# EAGLE design demo (EAGLE 9.6.2)
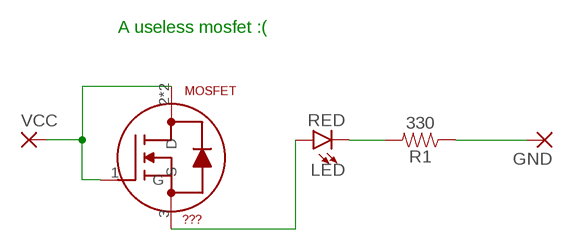
[diagram p0: schematic, sheet 1]

## Parts
GND  SMD2  [SMD1,27-2,54]
LED  RED  LED-RED1206  [LED-1206]
MOSFET  ???  CSTM_MOSFET  [CSTM_MOSFET]
R1  330  RESISTOR1206  [1206]
VCC  SMD2  [SMD1,27-2,54]

## Nets
N$1: GND.1(P) R1.1
N$2: LED.C R1.2
N$3: MOSFET.1(G) MOSFET.2(D) MOSFET.2B(D) VCC.1(P)
N$4: LED.A MOSFET.3(S)

## Notes on the sheet
- A useless mosfet :(

## Library data of the parts
GND VCC = wirepad:SMD2: SMD PAD
LED = SparkFun-LED:LED-RED: Red SMD LED Used in manufacturing of most products at SparkFun Packages: 0603 - SMD 0603 package [Product Link] <http://docs.avagotech.com/docs/AV02-0551EN> 0603 SMART - SMD 0603 SMART package ( more efficient and expensive)[Product Link] <http://www.osram-os.com/Graphics/XPic2/00077099_0.pdf> 1206 - SMD1206 package [Product Link] <https://www.sparkfun.com/datasheets/DevTools/LilyPad/Q150OVS4.pdff> SparkFun Products: Pro Mini 328 -5V <https://www.sparkfun.com/products/821> RedBoard <https://www.sparkfun.com/products/12757> IOIO-OTG <https://www.sparkfun.com/products/13613>; PROD_ID: DIO-09912
MOSFET = mylib:CSTM_MOSFET
R1 = SparkFun-Resistors:RESISTOR: Generic Resistor Package

## Board
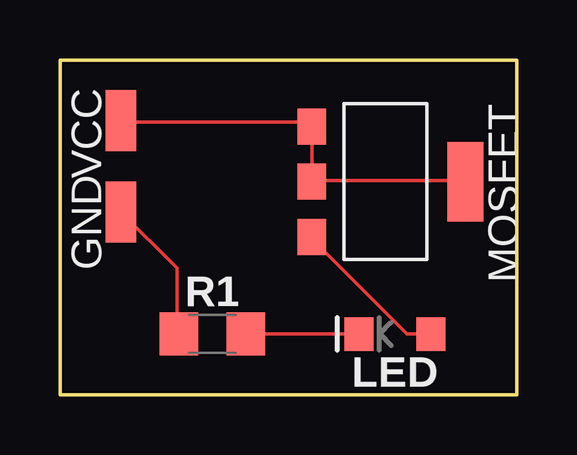
[diagram p1: board, top side]

Size 19.05 x 13.97 mm. Coordinates in mm from the lower left corner, seen from the top.
Outline: 0,0 0,13.97 19.05,13.97 19.05,0 0,0
Copper layers (1*16): Top 0.035mm / dielectric 1.5mm / Bottom 0.035mm
Design rules "default": minimum track width 6mil, minimum drill 0.35mm, track to track 6mil, track to pad 6mil, pad to pad 6mil, via to via 6mil, smd to smd 6mil, copper to edge 40mil, drill to drill 6mil, minimum pad ring 10mil, minimum via ring 8mil, stop-mask expansion 4mil, vias tented up to drill 0mil, thermal gap 10mil

### Footprints (pad centres in the part's own frame; a part is rotated, then mirrored left to right if it is on the bottom)
SMD1,27-2,54 = smd 1.27 x 2.54: 1 0,0
LED-1206 = smd 1.2 x 1.4: A -1.5,0; C 1.5,0
CSTM_MOSFET = smd 1.5 x 1.2: 1 -2.3,-2.2; 2 0,-2.2; 3 2.3,-2.2 | smd 3.3 x 1.5: 2B 0,4.2
1206 = smd 1.6 x 1.8: 1 -1.4,0; 2 1.4,0

### Placement (x,y rotation side)
GND  2.54,7.62 0 top
LED  13.97,2.54 180 top
MOSFET  12.7,8.89 270 top
R1  6.35,2.54 0 top
VCC  2.54,11.43 0 top

### Tracks (layer width: path | path; a pad name or v marks a point on that pad's centre or on a via)
N$1
  Top 0.152: 2.56,7.62 GND.1 4.88,5.28 4.88,2.54 R1.1
N$2
  Top 0.152: R1.2 LED.C
N$3
  Top 0.152: 10.52,8.94 10.52,11.07 MOSFET.1 10.36,11.23 10.21,11.38 2.59,11.38 VCC.1 | 10.52,8.94 16.76,8.94 MOSFET.2B | 10.52,8.94 MOSFET.2
N$4
  Top 0.152: LED.A 14.48,2.54 10.52,6.5 MOSFET.3